# Altium schematic sheet PowerMonitoring.SchDoc
size B
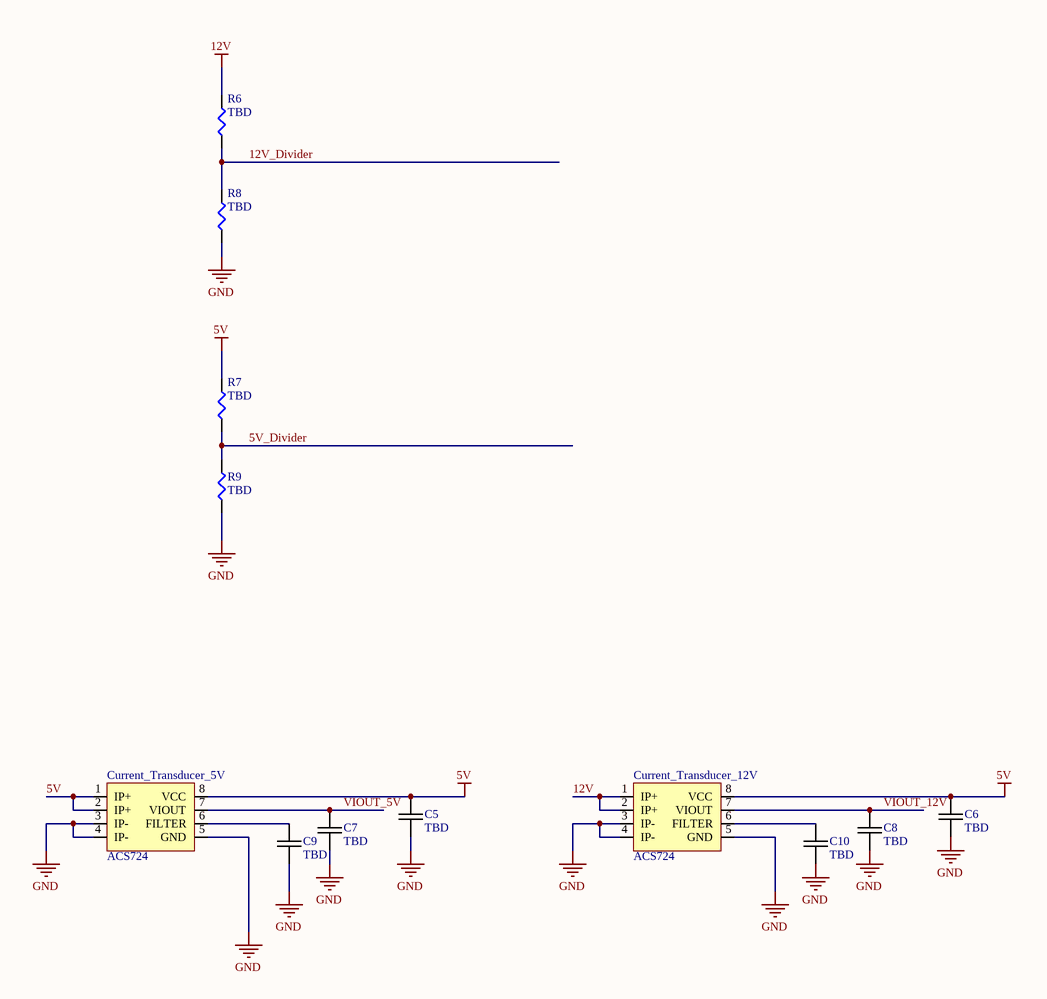
[diagram p0: PowerMonitoring.SchDoc]

## Parts
C5  TBD  [0805C-GENERIC]
C6  TBD  [0805C-GENERIC]
C7  TBD  [0805C-GENERIC]
C8  TBD  [0805C-GENERIC]
C9  TBD  [0805C-GENERIC]
C10  TBD  [0805C-GENERIC]
Current_Transducer_5V  ACS724  [SOIC-8 V3]
Current_Transducer_12V  ACS724  [SOIC-8 V3]
R6  TBD  [0805R-GENERIC]
R7  TBD  [0805R-GENERIC]
R8  TBD  [0805R-GENERIC]
R9  TBD  [0805R-GENERIC]

## Nets
5V: C5.1 C6.1 Current_Transducer_5V.1(IP+) Current_Transducer_5V.2(IP+) Current_Transducer_5V.8(VCC) Current_Transducer_12V.8(VCC) R7.2
12V: Current_Transducer_12V.1(IP+) Current_Transducer_12V.2(IP+) R6.2
GND: C5.2 C6.2 C7.2 C8.2 C9.2 C10.2 Current_Transducer_5V.3(IP-) Current_Transducer_5V.4(IP-) Current_Transducer_5V.5(GND) Current_Transducer_12V.3(IP-) Current_Transducer_12V.4(IP-) Current_Transducer_12V.5(GND) R8.1 R9.2
5V_Divider: R7.1 R9.1
12V_Divider: R6.1 R8.2
VIOUT_5V: C7.1 Current_Transducer_5V.7(VIOUT)
VIOUT_12V: C8.1 Current_Transducer_12V.7(VIOUT)
NetC9_1: C9.1 Current_Transducer_5V.6(FILTER)
NetC10_1: C10.1 Current_Transducer_12V.6(FILTER)

## Notes on the sheet
- Title
- Size:
- Date:
- B
- Number:
- Time:
- Revision:
- Sheet
- of
- File:

## Library data of the parts
C5-C10 = 0805C-TBD: CAPACITOR 0805 CERAMIC VALUE TO BE DETERMINED
R6-R9 = 0805R-TBD: RESISTOR 0805 VALUE TO BE DETERMINED